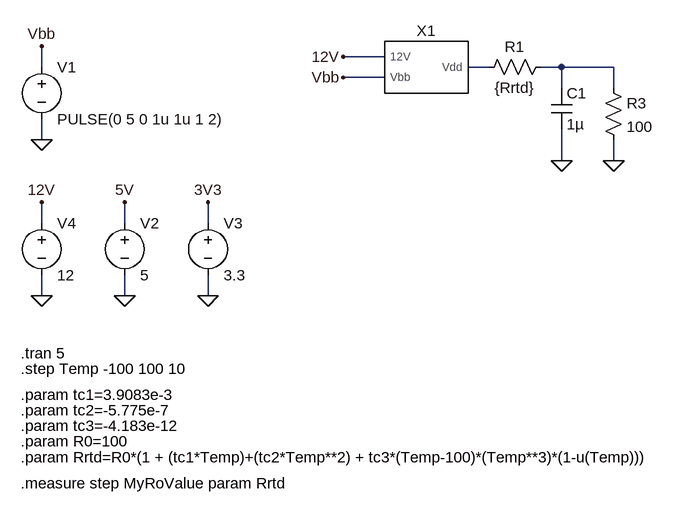
[diagram p0: schematic PDM-NTC-TM-test-0.asc]
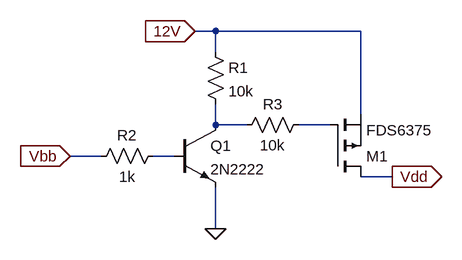
[diagram p1: sub-circuit pmos_5vl_12vp_hss.asc]
PDM-NTC-TM-test-0.asc, the LTspice schematic file:
Version 4
SHEET 1 1652 752
WIRE 480 80 416 80
WIRE -48 96 -48 64
WIRE 640 96 608 96
WIRE 752 96 720 96
WIRE 832 96 752 96
WIRE 480 112 416 112
WIRE 752 128 752 96
WIRE 832 128 832 96
WIRE -48 208 -48 176
WIRE 752 240 752 192
WIRE 832 240 832 208
WIRE -48 336 -48 304
WIRE 80 336 80 304
WIRE 208 336 208 304
WIRE -48 448 -48 416
WIRE 80 448 80 416
WIRE 208 448 208 416
FLAG -48 208 0
FLAG -48 64 Vbb
FLAG 80 448 0
FLAG 80 304 5V
FLAG 208 448 0
FLAG 208 304 3V3
FLAG -48 448 0
FLAG -48 304 12V
FLAG 832 240 0
FLAG 752 240 0
FLAG 416 80 12V
FLAG 416 112 Vbb
SYMBOL voltage -48 80 R0
WINDOW 123 0 0 Left 0
WINDOW 39 0 0 Left 0
SYMATTR InstName V1
SYMATTR Value PULSE(0 5 0 1u 1u 1 2)
SYMBOL voltage 80 320 R0
WINDOW 123 0 0 Left 0
WINDOW 39 0 0 Left 0
SYMATTR InstName V2
SYMATTR Value 5
SYMBOL voltage 208 320 R0
WINDOW 123 0 0 Left 0
WINDOW 39 0 0 Left 0
SYMATTR InstName V3
SYMATTR Value 3.3
SYMBOL voltage -48 320 R0
WINDOW 123 0 0 Left 0
WINDOW 39 0 0 Left 0
SYMATTR InstName V4
SYMATTR Value 12
SYMBOL res 816 112 R0
SYMATTR InstName R3
SYMATTR Value 100
SYMBOL cap 736 128 R0
SYMATTR InstName C1
SYMATTR Value 1µ
SYMBOL PMOS_5VL_12VP_HSS 544 96 R0
SYMATTR InstName X1
SYMBOL res 736 80 R90
WINDOW 0 0 56 VBottom 2
WINDOW 3 32 56 VTop 2
SYMATTR InstName R1
SYMATTR Value {Rrtd}
TEXT -80 536 Left 2 !.tran 5
TEXT -80 696 Left 2 !.param Rrtd=R0*(1 + (tc1*Temp)+(tc2*Temp**2) + tc3*(Temp-100)*(Temp**3)*(1-u(Temp)))
TEXT -80 672 Left 2 !.param R0=100
TEXT -80 648 Left 2 !.param tc3=-4.183e-12
TEXT -80 624 Left 2 !.param tc2=-5.775e-7
TEXT -80 600 Left 2 !.param tc1=3.9083e-3
TEXT -80 560 Left 2 !.step Temp -100 100 10
TEXT -80 736 Left 2 !.measure step MyRoValue param Rrtd

pmos_5vl_12vp_hss.asc, the sub-circuit schematic file:
Version 4
SHEET 1 1336 680
WIRE 960 -64 928 -64
WIRE 1184 -64 960 -64
WIRE 960 -32 960 -64
WIRE 1184 64 1184 -64
WIRE 960 80 960 48
WIRE 1008 80 960 80
WIRE 1136 80 1088 80
WIRE 784 128 736 128
WIRE 896 128 864 128
WIRE 1232 160 1184 160
WIRE 960 240 960 176
FLAG 960 240 0
FLAG 736 128 Vbb
IOPIN 736 128 In
FLAG 928 -64 12V
IOPIN 928 -64 In
FLAG 1232 160 Vdd
IOPIN 1232 160 Out
SYMBOL npn 896 80 R0
SYMATTR InstName Q1
SYMATTR Value 2N2222
SYMBOL res 944 -48 R0
SYMATTR InstName R1
SYMATTR Value 10k
SYMBOL res 880 112 R90
WINDOW 0 0 56 VBottom 2
WINDOW 3 32 56 VTop 2
SYMATTR InstName R2
SYMATTR Value 1k
SYMBOL pmos 1136 160 M180
SYMATTR InstName M1
SYMATTR Value FDS6375
SYMBOL res 1104 64 R90
WINDOW 0 0 56 VBottom 2
WINDOW 3 32 56 VTop 2
SYMATTR InstName R3
SYMATTR Value 10k

The netlist it stands for:
* PDM-NTC-TM-test-0.asc
V1 Vbb 0 PULSE(0 5 0 1u 1u 1 2)
V2 5V 0 5
V3 3V3 0 3.3
V4 12V 0 12
R3 N002 0 100
C1 N002 0 1µ
XX1 12V Vbb N001 pmos_5vl_12vp_hss
R1 N002 N001 {Rrtd}

* block symbol definitions
.subckt pmos_5vl_12vp_hss 12V Vbb Vdd
Q1 N001 N003 0 0 2N2222
R1 12V N001 10k
R2 N003 Vbb 1k
M1 Vdd N002 12V 12V FDS6375
R3 N002 N001 10k
.ends pmos_5vl_12vp_hss

.model NPN NPN
.model PNP PNP
.lib standard.bjt
.model NMOS NMOS
.model PMOS PMOS
.lib standard.mos
.tran 5
.param Rrtd=R0*(1 + (tc1*Temp)+(tc2*Temp**2) + tc3*(Temp-100)*(Temp**3)*(1-u(Temp)))
.param R0=100
.param tc3=-4.183e-12
.param tc2=-5.775e-7
.param tc1=3.9083e-3
.step Temp -100 100 10
.measure step MyRoValue param Rrtd
.backanno
.end